# Altium project JH Drive Board Project.PrjPcb
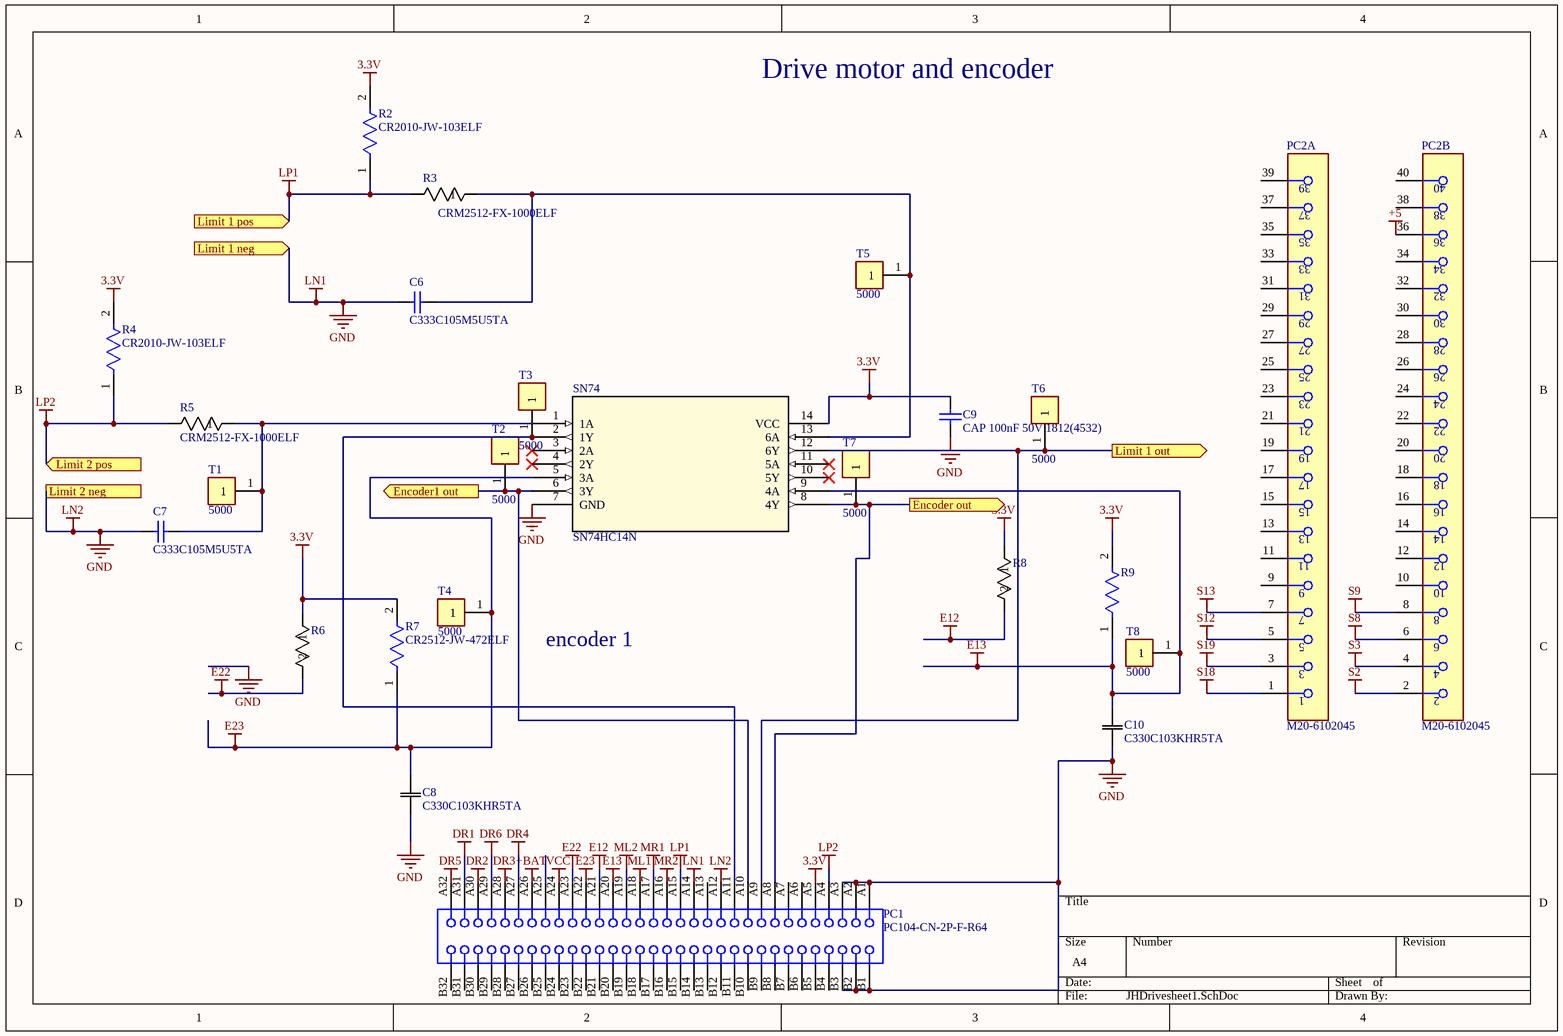
[diagram p0: JHDrivesheet1.SchDoc]
2 sheets, 36 parts. Net scope: flat (ports and power ports of the same name join across sheets).
Board file: JHDriverBoard.PcbDoc
Sheets:
  JHDrivesheet1.SchDoc
  JHDrivesheet2.SchDoc

## Sheet JHDrivesheet1.SchDoc
size A4; SheetNumber: 1; SheetTotal: 2

### Parts
C6  C333C105M5U5TA  [KEMT-C333C105M5U5TA-2]
C7  C333C105M5U5TA  [KEMT-C333C105M5U5TA-2]
C8  C330C103KHR5TA  [CAP_C330C_MR_COG_KEM]
C9  CAP 100nF 50V 1812(4532)  [CAPC1812(4532)100_M]
C10  C330C103KHR5TA  [CAP_C330C_MR_COG_KEM]
PC1  PC104-CN-2P-F-R64  [BTB2-54-V64F-04]
PC2  M20-6102045  [FP-M20-6102045-MFG]  (parts A,B of 2)
R2  CR2010-JW-103ELF  [FP-CR2010-IPC_C]
R3  CRM2512-FX-1000ELF  [BO_CR2512]
R4  CR2010-JW-103ELF  [FP-CR2010-IPC_C]
R5  CRM2512-FX-1000ELF  [BO_CR2512]
R6  CRM2512-FX-1000ELF  [BO_CR2512]  (value not drawn)
R7  CR2512-JW-472ELF  [FP-CR2512-IPC_A]
R8  CRM2512-FX-1000ELF  [BO_CR2512]  (value not drawn)
R9  CR2512-JW-472ELF  [FP-CR2512-IPC_A]  (value not drawn)
SN74  SN74HC14N  [N14]
T1  5000  [FP-5000-MFG]
T2  5000  [FP-5000-MFG]
T3  5000  [FP-5000-MFG]
T4  5000  [FP-5000-MFG]
T5  5000  [FP-5000-MFG]
T6  5000  [FP-5000-MFG]
T7  5000  [FP-5000-MFG]
T8  5000  [FP-5000-MFG]

### Ports
Encoder1 out (out), Encoder out (out), Limit 1 neg (in), Limit 1 out (out), Limit 1 pos (in), Limit 2 neg, Limit 2 pos (in)

### Nets
3.3V: C9.2 PC1.A5 R2.2 R4.2 R6.1 R7.2 R8.1 R9.2 SN74.14(VCC)
+5: PC2.36
+BAT: PC1.A26
DR1: PC1.A31
DR2: PC1.A30
DR3: PC1.A28
DR4: PC1.A27
DR5: PC1.A32
DR6: PC1.A29
E12: PC1.A21 R8.2
E13: C10.2 PC1.A20 R9.1 SN74.9(4A) T8.1
E22: PC1.A23 R6.2
E23: C8.2 PC1.A22 R7.1 SN74.5(3A) T4.1
GND: C6.1 C7.1 C8.1 C9.1 C10.1 PC1.A1 PC1.A2 PC1.A3 PC1.A12 PC1.A14 PC1.B1 PC1.B2 PC1.B3 SN74.7(GND) ; port Limit 1 neg, port Limit 2 neg  [also labelled LN1, LN2]
LP1: PC1.A15 R2.1 R3.2 ; port Limit 1 pos
LP2: PC1.A4 R4.1 R5.2 ; port Limit 2 pos
ML1: PC1.A18
ML2: PC1.A19
MR1: PC1.A17
MR2: PC1.A16
S2: PC2.2
S3: PC2.4
S8: PC2.6
S9: PC2.8
S12: PC2.5
S13: PC2.7
S18: PC2.1
S19: PC2.3
VCC: PC1.A24
NetC6_2: C6.2 R3.1 SN74.13(6A) T5.1
NetC7_2: C7.2 R5.1 SN74.1(1A) T1.1
NetPC1_A8: PC1.A8 SN74.8(4Y) T7.1 ; port Encoder out
NetPC1_A9: PC1.A9 SN74.12(6Y) T6.1 ; port Limit 1 out
NetPC1_A10: PC1.A10 SN74.6(3Y) T2.1 ; port Encoder1 out
NetPC1_A11: PC1.A11 SN74.2(1Y) T3.1

Not connected (* = marked no-connect by the designer): PC1 A6(6) A7(7) A13(13) A25(25) B4(36) B5(37) B6(38) B7(39) B8(40) B9(41) B10(42) B11(43) B12(44) B13(45) B14(46) B15(47) B16(48) B17(49) B18(50) B19(51) B20(52) B21(53) B22(54) B23(55) B24(56) B25(57) B26(58) B27(59) B28(60) B29(61) B30(62) B31(63) B32(64); PC2 9 10 11 12 13 14 15 16 17 18 19 20 21 22 23 24 25 26 27 28 29 30 31 32 33 34 35 37 38 39 40; SN74 3(2A)* 4(2Y)* 10(5Y)* 11(5A)*

### Notes on the sheet
- Drive motor and encoder
- encoder 1

### Library data of the parts
C6 C7 = CMP-2000-05174-1: Multilayer Ceramic Capacitor / Axial and Radial Leaded, 1 uF, +/- 20%, 10 to 85 degC, 2-Pin THD, RoHS, Bulk; Manufacturer: Kemet; Voltage Rating: 50V; Temperature Coefficient / Code: Z5U; Case Height: 3.81mm; Lead Diameter: 0.51mm; Case Style: ConformallyCoated; Dissipation Factor DF: 4; Capacitance: 1uF; Case Length: 9.91mm; Type: RadialLeads; Case Width: 7.62mm; Dimensions: 7.62mmWx9.91mmLx3.81mmH; Termination Style: Radial; Factory Pack Quantity: 250; Packaging: Bulk; RoHS: Details; Datasheet Version: Jul-09; Lead Spacing: 5.08mm; Product Category: MultilayerCeramicCapacitorsMLCC-Leaded; Maximum Operating Temperature: +125C; Product: GeneralTypeMLCCs; Manufacturer URL: http://www.kemet.com/; Lead Style: InsideBend; Operating Temperature Range: -55Cto+125C; Datasheet URL: http://www.farnell.com/datasheets/706880.pdf; Voltage Rating DC: 50V; Brand: Kemet; Series: C333; Tolerance: 20%; Minimum Operating Temperature: -55C
C8 C10 = C330C103KHR5TA: No Description Available; Mfr_Name: Kemet; Type: DEV; Copyright: Copyright (C) 2023 Ultra Librarian. All rights reserved.; Manufacturer_Part_Number: C330C103KHR5TA; RefDes: RefDes
C9 = CMP-1040-01293-1: CAP 100nF 50V ±20% 1812 (4532 Metric) Thickness 1mm SMD; Case-Metric: 4532; Tolerance: Â±20%; Case-EIA: 1812; Rated Voltage: 50 V; Value: 100nF; Max Thickness: 1 mm; Technology: SMT
PC1 = CMP-0001-00110-1: Board-to-Board Connector, PC104 BA ISA, Stackthrough, Vertical, 2-Row, 64-Postion, Pitch 2.54mm,  Receptacle, Height 11.05mm; Mating Connector: Harwin-M20-6103205 (stackthrough); Publisher: Altium; ClassName: Board Template Connector; Component Kind: Standard; Package Reference: BTB2-54-V64F-04
PC2 = CMP-15831-000080-1: CONN STKTHRU PC/104 40POS PCB; Current Rating: 3A; Pitch: 2.54mm; Insulation Resistance: 5GR; Contact Resistance: 30mR; Number of Positions: 40; Gender: Receptacle; REACH SVHC: No SVHC; Housing Material: Nylon; Number of Rows: 2; Min Operating Temperature: -55°C; Contact Plating: Gold; Orientation: Straight; Mount: Through Hole; Contact Material: Bronze; Length: 51.46mm; Weight: 0.218205oz; Number of Contacts: 40; Packaging: Rail/Tube; Depth: 5.25mm; Termination: Solder; Radiation Hardening: No; Flammability Rating: UL94 V-0; Housing Color: Black; Max Operating Temperature: 105°C; Material: Nylon; Package Quantity: 11; Color: Black; Max Current Rating: 3A; Series: M20
R2 R4 = CMP-07231-003456-1: Thick Film Chip Resistors 2010 10kΩ 0.5W 5% 200ppm/°C; Resistance: 10kR; Voltage Rating: 200V; Power Rating: 500mW; Tolerance: 5%; Contact Plating: Tin; Length: 5mm; Case/Package: 2010; Package Quantity: 4000; Max Operating Temperature: 155°C; Case Code (Imperial): 2010; Mount: Surface Mount; Case Code (Metric): 5025; Width: 2.5mm; Temperature Coefficient: 200ppm/°C; Packaging: Tape and Reel; Height: 0.6mm; Radiation Hardening: No; Composition: Thick Film; Min Operating Temperature: -55°C; Termination: SMD/SMT
R3 R5 R6 R8 = CRM2512-FX-1000ELF: No Description Available; Mfr_Name: Bourns Electronics; Copyright: Copyright (C) 2023 Ultra Librarian. All rights reserved.; Manufacturer_Part_Number: CRM2512-FX-1000ELF; RefDes: RefDes; Type: DEV
R7 R9 = CMP-1018-00090-2: Thick Film Chip Resistors 2512 4.7kΩ 1W 5% 200ppm/°C; Resistance: 4.7kR; Voltage Rating: 200V; RoHS Compliant: Yes; Max Power Dissipation: 1W; Number of Terminations: 2; Length: 0.248inch; Termination: SMD/SMT; Case/Package: 2512; Max Operating Temperature: 155°C; Series: CR2512; Package Quantity: 4000; Tolerance: 5%; Power Rating: 1W; Case Code (Metric): 6332; Temperature Coefficient: 200ppm/°C; Height: 0.03inch; Case Code (Imperial): 2512; Width: 0.122inch; Packaging: Tape and Reel; Resistor Type: Thick Film; Mount: Surface Mount; Min Operating Temperature: -55°C
SN74 = SN74HC14N: No Description Available; Mfr_Name: Texas Instruments; Copyright: Copyright (C) 2023 Ultra Librarian. All rights reserved.; Manufacturer_Part_Number: SN74HC14N; RefDes: RefDes; Type: DEV
T1-T8 = CMP-19636-000027-1: PC TEST POINT MINIATURE RED; Outside Diameter: 2.54mm; Body Material: Bronze; Number of Contacts: 1; Insulation: Insulated; Inside Diameter: 1.27mm; Hole Diameter: 1.6mm; Plating: Silver; Material: Nylon; Length: 7.62mm; Package Quantity: 100; Number of Ports: 1; Contact Material: Bronze; Orientation: Straight; RoHS Compliant: Yes; Housing Color: Red; Height: 0.3inch; Series: THM; Lead Free: Lead Free; Color: Red; Contact Plating: Tin; Mount: PCB; Packaging: Bulk; REACH SVHC: No SVHC; Flammability Rating: UL94 V-0

## Sheet JHDrivesheet2.SchDoc
size A4; SheetNumber: 2; SheetTotal: 2
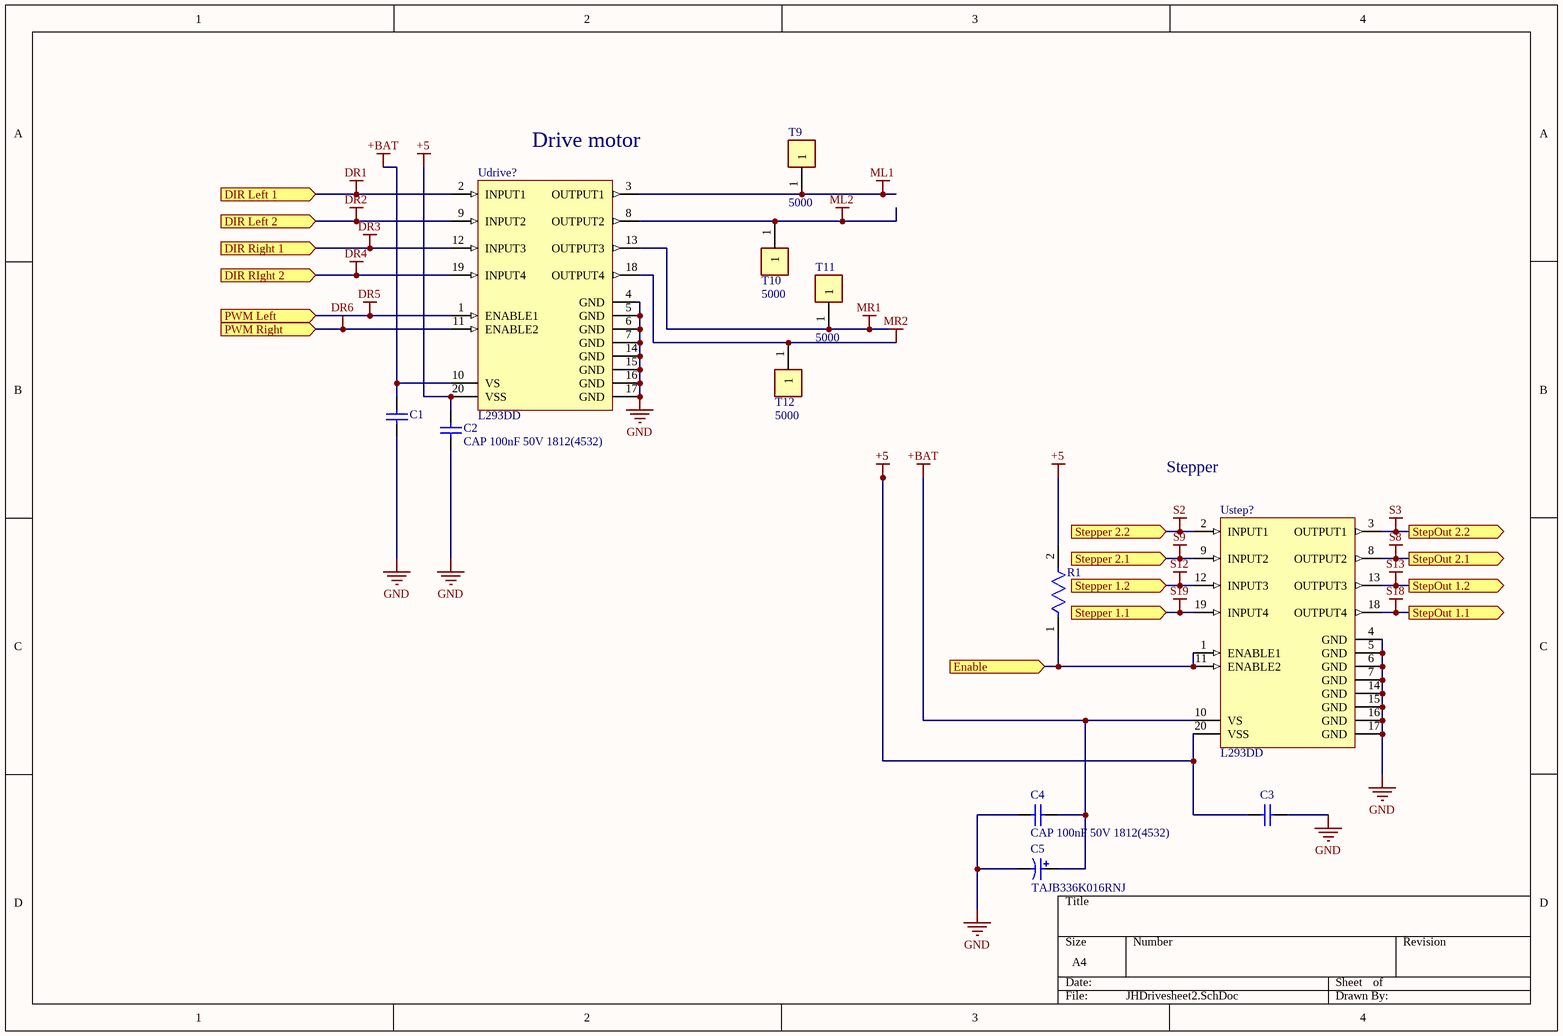
[diagram p1: JHDrivesheet2.SchDoc]

### Parts
C1  C333C105M5U5TA  [KEMT-C333C105M5U5TA-2]  (value not drawn)
C2  CAP 100nF 50V 1812(4532)  [CAPC1812(4532)100_M]
C3  CAP 100nF 50V 1812(4532)  [CAPC1812(4532)100_M]  (value not drawn)
C4  CAP 100nF 50V 1812(4532)  [CAPC1812(4532)100_M]
C5  TAJB336K016RNJ  [CAPMP3529X21-T_V]
R1  CR2010-JW-103ELF  [FP-CR2010-IPC_C]  (value not drawn)
T9  5000  [FP-5000-MFG]
T10  5000  [FP-5000-MFG]
T11  5000  [FP-5000-MFG]
T12  5000  [FP-5000-MFG]
Udrive?  L293DD  [STM-SOIC-20_M]
Ustep?  L293DD  [STM-SOIC-20_M]

### Ports
DIR Left 1 (in), DIR Left 2 (in), DIR Right 1 (in), DIR RIght 2 (in), Enable (in), PWM Left (in), PWM Right (in), StepOut 1.1 (out), StepOut 1.2 (out), StepOut 2.1 (out), StepOut 2.2 (out), Stepper 1.1 (in), Stepper 1.2 (in), Stepper 2.1 (in), Stepper 2.2 (in)

### Nets
+5: C2.2 C3.1 R1.2 Udrive?.20(VSS) Ustep?.20(VSS)
+BAT: C1.2 C4.2 C5.1 Udrive?.10(VS) Ustep?.10(VS)
DR1: Udrive?.2(INPUT1) ; port DIR Left 1
DR2: Udrive?.9(INPUT2) ; port DIR Left 2
DR3: Udrive?.12(INPUT3) ; port DIR Right 1
DR4: Udrive?.19(INPUT4) ; port DIR RIght 2
DR5: Udrive?.1(ENABLE1) ; port PWM Left
DR6: Udrive?.11(ENABLE2) ; port PWM Right
GND: C1.1 C2.1 C3.2 C4.1 C5.2 Udrive?.4(GND) Udrive?.5(GND) Udrive?.6(GND) Udrive?.7(GND) Udrive?.14(GND) Udrive?.15(GND) Udrive?.16(GND) Udrive?.17(GND) Ustep?.4(GND) Ustep?.5(GND) Ustep?.6(GND) Ustep?.7(GND) Ustep?.14(GND) Ustep?.15(GND) Ustep?.16(GND) Ustep?.17(GND)
ML1: T9.1 Udrive?.3(OUTPUT1)
ML2: T10.1 Udrive?.8(OUTPUT2)
MR1: T11.1 Udrive?.13(OUTPUT3)
MR2: T12.1 Udrive?.18(OUTPUT4)
S2: Ustep?.2(INPUT1) ; port Stepper 2.2
S3: Ustep?.3(OUTPUT1) ; port StepOut 2.2
S8: Ustep?.8(OUTPUT2) ; port StepOut 2.1
S9: Ustep?.9(INPUT2) ; port Stepper 2.1
S12: Ustep?.12(INPUT3) ; port Stepper 1.2
S13: Ustep?.13(OUTPUT3) ; port StepOut 1.2
S18: Ustep?.18(OUTPUT4) ; port StepOut 1.1
S19: Ustep?.19(INPUT4) ; port Stepper 1.1
NetR1_1: R1.1 Ustep?.1(ENABLE1) Ustep?.11(ENABLE2) ; port Enable

### Notes on the sheet
- (near Udrive?) Drive motor
- Stepper

### Library data of the parts
C1 = CMP-2000-05174-1: as C6 on sheet JHDrivesheet1; Dimensions: 7.62mmWx9.91mmLx3.81mmH; Termination Style: Radial; Factory Pack Quantity: 250; Packaging: Bulk; RoHS: Details; Datasheet Version: Jul-09; Lead Spacing: 5.08mm; Product Category: MultilayerCeramicCapacitorsMLCC-Leaded; Maximum Operating Temperature: +125C; Product: GeneralTypeMLCCs; Manufacturer URL: http://www.kemet.com/; Lead Style: InsideBend; Operating Temperature Range: -55Cto+125C; Datasheet URL: http://www.farnell.com/datasheets/706880.pdf; Voltage Rating DC: 50V; Brand: Kemet; Series: C333; Tolerance: 20%; Minimum Operating Temperature: -55C
C2-C4 = CMP-1040-01293-1: as C9 on sheet JHDrivesheet1; Rated Voltage: 50 V; Value: 100nF; Max Thickness: 1 mm; Technology: SMT
C5 = CMP-2000-07224-1: Standard Tantalum, 33 uF, +/- 10%, 16 V, -55 to 125 degC, 2-Pin SMD, RoHS, Tape and Reel; Manufacturer: AVX; Manufacturer Size Code: B; PCN Part Number: TAJSeriesSuffix08/Dec/2008; Other Names: 478-1688-1; Kits: 478-3443-ND-KITTANTCAPTAJSERIES; Product Training Modules: ComponentSolutionsforSmartMeterApplications; Catalog Drawings: TAJSeriesSideTAJSeries; ESR (Equivalent Series Resistance): 2.1Ohm; EDA / CAD Models: DownloadfromAcceleratedDesigns; Capacitance: 33µF; Voltage - Rated: 16V; Type: Molded; Online Catalog: TAJSeries; Lead Spacing: -; Family: TantalumCapacitors; Series: TAJ; Package Reference: CAPMP3529X21-T; Package / Case: 1210(3528Metric); Category: Capacitors; Packaging: CutTape(CT); Lifetime @ Temp.: -; Package URL: http://www.avx.com/download/software/literature/AVX-Footprint-Library.pdf; Tolerance: ±10%; Manufacturer URL: http://www.avx.com/; Package Description: 2-Pin Surface Mount Device, Body 3.5 x 2.85 mm; Features: GeneralPurpose; Height - Seated (Max): 0.083"(2.10mm); Mounting Technology: SurfaceMount; Datasheet Version: 02/2016; Datasheet URL: http://datasheets.avx.com/TAJ.pdf; Operating Temperature: -55°C~125°C; Standard Package: 1; Size / Dimension: 0.138"Lx0.110"W(3.50mmx2.80mm); Mounting Type: SurfaceMount
R1 = CMP-07231-003456-1: as R2 on sheet JHDrivesheet1; Tolerance: 5%; Contact Plating: Tin; Length: 5mm; Case/Package: 2010; Package Quantity: 4000; Max Operating Temperature: 155°C; Case Code (Imperial): 2010; Mount: Surface Mount; Case Code (Metric): 5025; Width: 2.5mm; Temperature Coefficient: 200ppm/°C; Packaging: Tape and Reel; Height: 0.6mm; Radiation Hardening: No; Composition: Thick Film; Min Operating Temperature: -55°C; Termination: SMD/SMT
T9-T12 = CMP-19636-000027-1: as T1 on sheet JHDrivesheet1; Length: 7.62mm; Package Quantity: 100; Number of Ports: 1; Contact Material: Bronze; Orientation: Straight; RoHS Compliant: Yes; Housing Color: Red; Height: 0.3inch; Series: THM; Lead Free: Lead Free; Color: Red; Contact Plating: Tin; Mount: PCB; Packaging: Bulk; REACH SVHC: No SVHC; Flammability Rating: UL94 V-0
Udrive? Ustep? = CMP-1771-00003-1: Push-Pull Four Channel Driver with Diodes, 4.5 to 36 V, 20-Pin SOIC, RoHS, Tube; Voltage Rating: 50 V; Power Rating: 100 mW; Case\Package: 0603; Resistance: 15 kohm; Tolerance: 1%; REACH SVHC: Unknown; Case Code (Imperial): 0603; ComponentLink2Description: Datasheet; ComponentLink2URL: http://www.st.com/content/ccc/resource/technical/document/datasheet/04/ac/22/f9/20/5d/43/a1/CD00000059.pdf/files/CD00000059.pdf/jcr:content/translations/en.CD00000059.pdf; Max Operating Temperature: 155 degC; Width: 0.8 mm; ComponentLink1URL: http://www.st.com/; ComponentLink1Description: Manufacturer URL; Length: 1.6 mm; Package Quantity: 5000; RoHSCompliant: true; Height: 0.45 mm; Mount: Surface Mount; PackageDescription: 20-Pin Small Outline Integrated Circuit, Body 12.8 x 7.5 mm, Pitch 1.27 mm; PackageReference: SOIC-20; Packaging: Tape and Reel; Min Operating Temperature: -55 degC; Case Code (Metric): 1608; DatasheetVersion: Jul-03

## Nets that join several sheets
+5: JHDrivesheet1 (PC2.36), JHDrivesheet2 (5 pins)
+BAT: JHDrivesheet1 (PC1.A26), JHDrivesheet2 (5 pins)
DR1: JHDrivesheet1 (PC1.A31), JHDrivesheet2 (Udrive?.2)
DR2: JHDrivesheet1 (PC1.A30), JHDrivesheet2 (Udrive?.9)
DR3: JHDrivesheet1 (PC1.A28), JHDrivesheet2 (Udrive?.12)
DR4: JHDrivesheet1 (PC1.A27), JHDrivesheet2 (Udrive?.19)
DR5: JHDrivesheet1 (PC1.A32), JHDrivesheet2 (Udrive?.1)
DR6: JHDrivesheet1 (PC1.A29), JHDrivesheet2 (Udrive?.11)
GND: JHDrivesheet1 (14 pins), JHDrivesheet2 (21 pins)
ML1: JHDrivesheet1 (PC1.A18), JHDrivesheet2 (T9.1 Udrive?.3)
ML2: JHDrivesheet1 (PC1.A19), JHDrivesheet2 (T10.1 Udrive?.8)
MR1: JHDrivesheet1 (PC1.A17), JHDrivesheet2 (T11.1 Udrive?.13)
MR2: JHDrivesheet1 (PC1.A16), JHDrivesheet2 (T12.1 Udrive?.18)
S2: JHDrivesheet1 (PC2.2), JHDrivesheet2 (Ustep?.2)
S3: JHDrivesheet1 (PC2.4), JHDrivesheet2 (Ustep?.3)
S8: JHDrivesheet1 (PC2.6), JHDrivesheet2 (Ustep?.8)
S9: JHDrivesheet1 (PC2.8), JHDrivesheet2 (Ustep?.9)
S12: JHDrivesheet1 (PC2.5), JHDrivesheet2 (Ustep?.12)
S13: JHDrivesheet1 (PC2.7), JHDrivesheet2 (Ustep?.13)
S18: JHDrivesheet1 (PC2.1), JHDrivesheet2 (Ustep?.18)
S19: JHDrivesheet1 (PC2.3), JHDrivesheet2 (Ustep?.19)